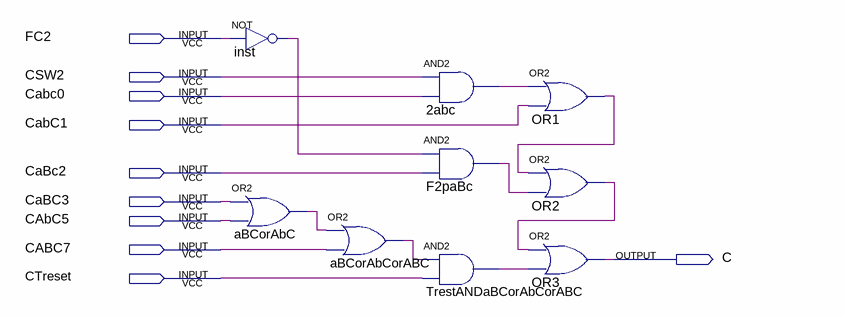
[diagram p0: schematic sheet]
// Quartus schematic C.bdf as structural Verilog: 9 symbols, 10 pins
module C (
  input  FC2,
  input  CSW2,
  input  Cabc0,
  input  CabC1,
  input  CaBc2,
  input  CaBC3,
  input  CAbC5,
  input  CABC7,
  input  CTreset,
  output C
);

  wire aBCorAbC_out, aBCorAbCorABC_out, F2paBc_out, inst_out, n2abc_out, OR1_out, OR2_out,
       TrestANDaBCorAbCorABC_out;

  not inst (inst_out, FC2);
  or aBCorAbC (aBCorAbC_out, CaBC3, CAbC5);
  or aBCorAbCorABC (aBCorAbCorABC_out, aBCorAbC_out, CABC7);
  and u_2abc (n2abc_out, CSW2, Cabc0);
  and F2paBc (F2paBc_out, inst_out, CaBc2);
  and TrestANDaBCorAbCorABC (TrestANDaBCorAbCorABC_out, aBCorAbCorABC_out, CTreset);
  or OR1 (OR1_out, n2abc_out, CabC1);
  or OR2 (OR2_out, OR1_out, F2paBc_out);
  or OR3 (C, OR2_out, TrestANDaBCorAbCorABC_out);
endmodule
